# Altium schematic sheet MAIN_STM32F301K8U6.SchDoc
size B; SheetNumber: 4
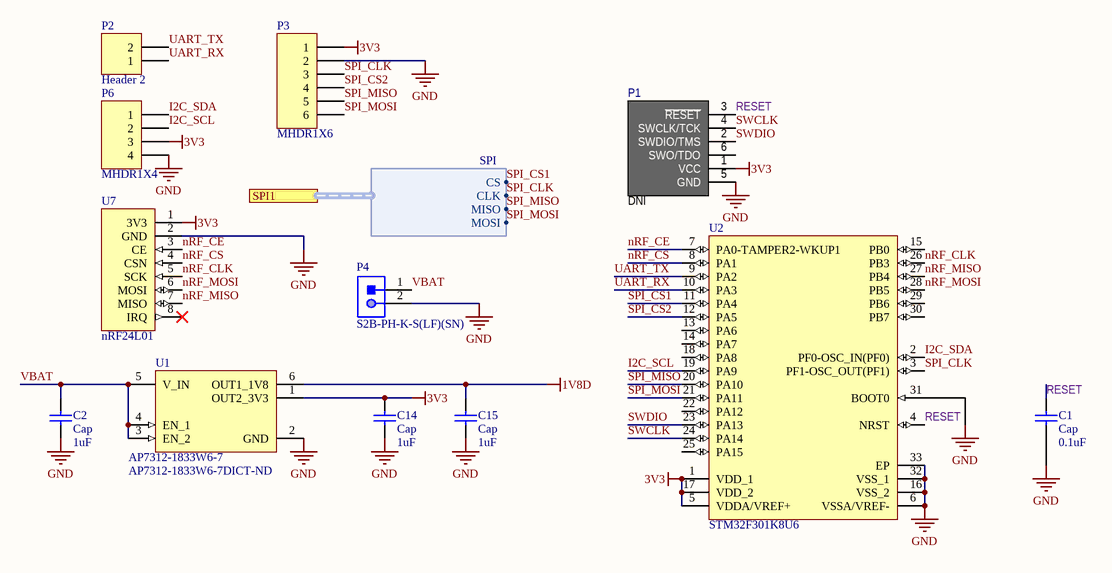
[diagram p0: MAIN_STM32F301K8U6.SchDoc]

## Parts
C1  Cap  value 0.1uF  [CAPC1005N]
C2  Cap  value 1uF  [CAPC1005N]
C14  Cap  value 1uF  [CAPC1005N]
C15  Cap  value 1uF  [CAPC1005N]
P1  DNI  [TC2030-NL]  (no BOM)
P2  Header 2  [MHDR1X2]
P3  MHDR1X6  [MHDR1X6]
P4  S2B-PH-K-S(LF)(SN)  [JST-S2B-PH-K-S_V]
P6  MHDR1X4  [MHDR1X4]
U1  AP7312-1833W6-7  Supplier Part Number 1: AP7312-1833W6-7DICT-ND  [SOT95P285X145-6N]
U2  STM32F301K8U6  [STM-UFQFPN32_L]
U7  nRF24L01  [MHDR1X8]

## Ports
SPI1 (harness SPI)

## Harnesses
SPI: MOSI, MISO, CS, CLK

## Nets
1V8D: C15.2 U1.6(OUT1_1V8)
3V3: C14.2 P1.1(VCC) P3.1 P6.3 U1.1(OUT2_3V3) U2.1(VDD_1) U2.5(VDDA/VREF+) U2.17(VDD_2) U7.1(3V3)
GND: C1.1 C2.1 C14.1 C15.1 P1.5(GND) P3.2 P4.2 P6.4 U1.2(GND) U2.6(VSSA/VREF-) U2.16(VSS_2) U2.31(BOOT0) U2.32(VSS_1) U2.33(EP) U7.2(GND)
I2C_SCL: P6.2 U2.19(PA9)
I2C_SDA: P6.1 U2.2(PF0-OSC_IN(PF0))
nRF_CE: U2.7(PA0-TAMPER2-WKUP1) U7.3(CE)
nRF_CLK: U2.26(PB3) U7.5(SCK)
nRF_CS: U2.8(PA1) U7.4(CSN)
nRF_MISO: U2.27(PB4) U7.7(MISO)
nRF_MOSI: U2.28(PB5) U7.6(MOSI)
RESET: C1.2 P1.3(~{RESET}) U2.4(NRST)
SPI_CLK: P3.3 U2.3(PF1-OSC_OUT(PF1)) ; port SPI1.CLK
SPI_CS1: U2.11(PA4) ; port SPI1.CS
SPI_CS2: P3.4 U2.12(PA5)
SPI_MISO: P3.5 U2.20(PA10) ; port SPI1.MISO
SPI_MOSI: P3.6 U2.21(PA11) ; port SPI1.MOSI
SWCLK: P1.4(SWCLK/TCK) U2.24(PA14)
SWDIO: P1.2(SWDIO/TMS) U2.23(PA13)
UART_RX: P2.1 U2.10(PA3)
UART_TX: P2.2 U2.9(PA2)
VBAT: C2.2 P4.1 U1.3(EN_2) U1.4(EN_1) U1.5(V_IN)

Not connected (* = marked no-connect by the designer): P1 6(SWO/TDO); U2 13(PA6) 14(PA7) 15(PB0) 18(PA8) 22(PA12) 25(PA15) 29(PB6) 30(PB7); U7 8(IRQ)*

## Library data of the parts
C1 C2 C14 C15 = Cap: Capacitor; Published: 8-Jun-2000; LatestRevisionDate: 17-Jul-2002; LatestRevisionNote: Re-released for DXP Platform.; PackageReference: RAD-0.3; Publisher: Altium Limited; PackageDescription: Radial Cap, Thru-Hole; 2 Leads; 0.3 in Pin Spacing
P1 = TC2030-CTX
P2 = Header 2: Header, 2-Pin; LatestRevisionDate: 17-Jul-2002; LatestRevisionNote: Re-released for DXP Platform.; Publisher: Altium Limited
P3 = MHDR1X6: Header, 6-Pin; LatestRevisionDate: 17-Jul-2002; LatestRevisionNote: Re-released for DXP Platform.; Publisher: Altium Limited
P4 = CMP-1755-00004-1: Male Header, Pitch 2 mm, 1 x 2 Position, Height 4.8 mm, Tail Length 3.4 mm, -25 to 85 degC, RoHS, Bulk; Case\Package: Radial; Tolerance: 20%; Capacitance: 10 uF; Voltage Rating (DC): 50 V; Packaging: Bulk; ComponentLink1URL: http://www.jst-mfg.com/product/pdf/eng/ePH.pdf; Radiation Hardening: No; Height: 11 mm; Package Quantity: 200; PackageDescription: Male Header, Pitch 2 mm, 1 x 2 Position, Height 4.8 mm, Tail Length 3.4 mm; PackageReference: S2B-PH-K-S; Diameter: 5 mm; Pins: 2; Mount: Through Hole; Max Operating Temperature: 85 degC; Min Operating Temperature: -40 degC; ComponentLink1Description: Datasheet; DatasheetVersion: Dec-12; Length: 11 mm; Lead Pitch: 2 mm; REACH SVHC: No SVHC; Voltage Rating: 50 V; RoHSCompliant: true
P6 = MHDR1X4: Header, 4-Pin; LatestRevisionDate: 17-Jul-2002; LatestRevisionNote: Re-released for DXP Platform.; Publisher: Altium Limited
U1 = AP7312-1833W6-7: IC REG LINEAR 1.8V/3.3V SOT26; Manufacturer 1: Diodes; Number of Outputs: 2; Min Input Voltage: 2V; Max Input Voltage: 6V; Max Output Current: 150mA; Max Power Dissipation: 950mW; Polarity: Positive; Quiescent Current: 80uA; Accuracy: 2%; Output Type: Fixed; Dropout Voltage: 150mV; Output Voltage: 3.3V; Min Current Limit: 200mA; Operating Supply Current: 60uA; Voltage - Output 1: 1.8V; Reference Voltage: 800mV; Power Supply Rejection Ratio (PSRR): 65dB; Supplier 1: Digi-Key; Manufacturer Part Number 1: AP7312-1833W6-7; Stock 1: 17585; Pricing 1: 1=0.59000, 10=0.52100, 100=0.37100, 500=0.29994, 1000=0.22890 (USD); RoHS: Yes; Mount: Surface Mount; Case/Package: SOT-26; Number of Pins: 6; Contact Plating: Tin,Matte; Min Operating Temperature: -40°C; Max Operating Temperature: 85°C; Output Current: 150mA; Package Quantity: 3000; Packaging: Tape and Reel; Power Rating: 950mW; Number of Regulators: 2; Current - Output 1: 150mA; Current - Output 2: 150mA; Voltage - Output 2: 3.3V; Power Dissipation: 950mW; Output Voltage Accuracy: 2%; Length: 3.1mm; Height: 1.3mm; Width: 1.7mm; Radiation Hardening: No; REACH SVHC: No SVHC; Lead Free: Lead Free; ComponentLink1URL: https://datasheet.ciiva.com/30477/0900766b8115c2c0-30477178.pdf?src-supplier=RSComponents; ComponentLink1Description: https://datasheet.ciiva.com/30477/0900766b8115c2c0-30477178.pdf?src-supplier=RSComponents; ComponentLink2URL: https://datasheet.ciiva.com/8078/1636610-8078247.pdf?src-supplier=Element14; ComponentLink2Description: https://datasheet.ciiva.com/8078/1636610-8078247.pdf?src-supplier=Element14; ComponentLink3URL: https://datasheet.ciiva.com/8239/ap7312-8239997.pdf?src-supplier=Avnet; ComponentLink3Description: https://datasheet.ciiva.com/8239/ap7312-8239997.pdf?src-supplier=Avnet
U2 = CMP-0537-00006-1: ARM Cortex-M4 32-bit MCU, 64 KB Flash, 16 KB Internal RAM, 24 I/Os, 32-Pin UFQFPN, -40 to 85 degC, Tray; Operating Frequency(F) (Processor speed) (MHz): 72; Internal RAM Size (kB): 16; D/A Converter: 1; FLASH Size (Prog) (kB): 64; I/Os (High Current): 24; Supply Voltage(Vcc) min (V): 2; DatasheetVersion: Rev. 6; Core: ARM Cortex-M4; ComponentLink2Description: Datasheet; Packing: Tray; ComponentLink2URL: http://www.st.com/st-web-ui/static/active/en/resource/technical/document/datasheet/DM00093332.pdf; Package Reference: UFQFPN32; ComponentLink1Description: Manufacturer URL; Mounting Technology: Surface Mount; ComponentLink1URL: http://www.st.com/; Package Description: 32-Pin Ultra Thin Fine Pitch Quad Flat No-Lead, 5 x 5 x 0.6 mm Body, 0.5 mm Pitch, Exposed Pad 3.5 x 3.5 mm